# Altium schematic sheet MainPCB.SchDoc
size 381 x 241 mm
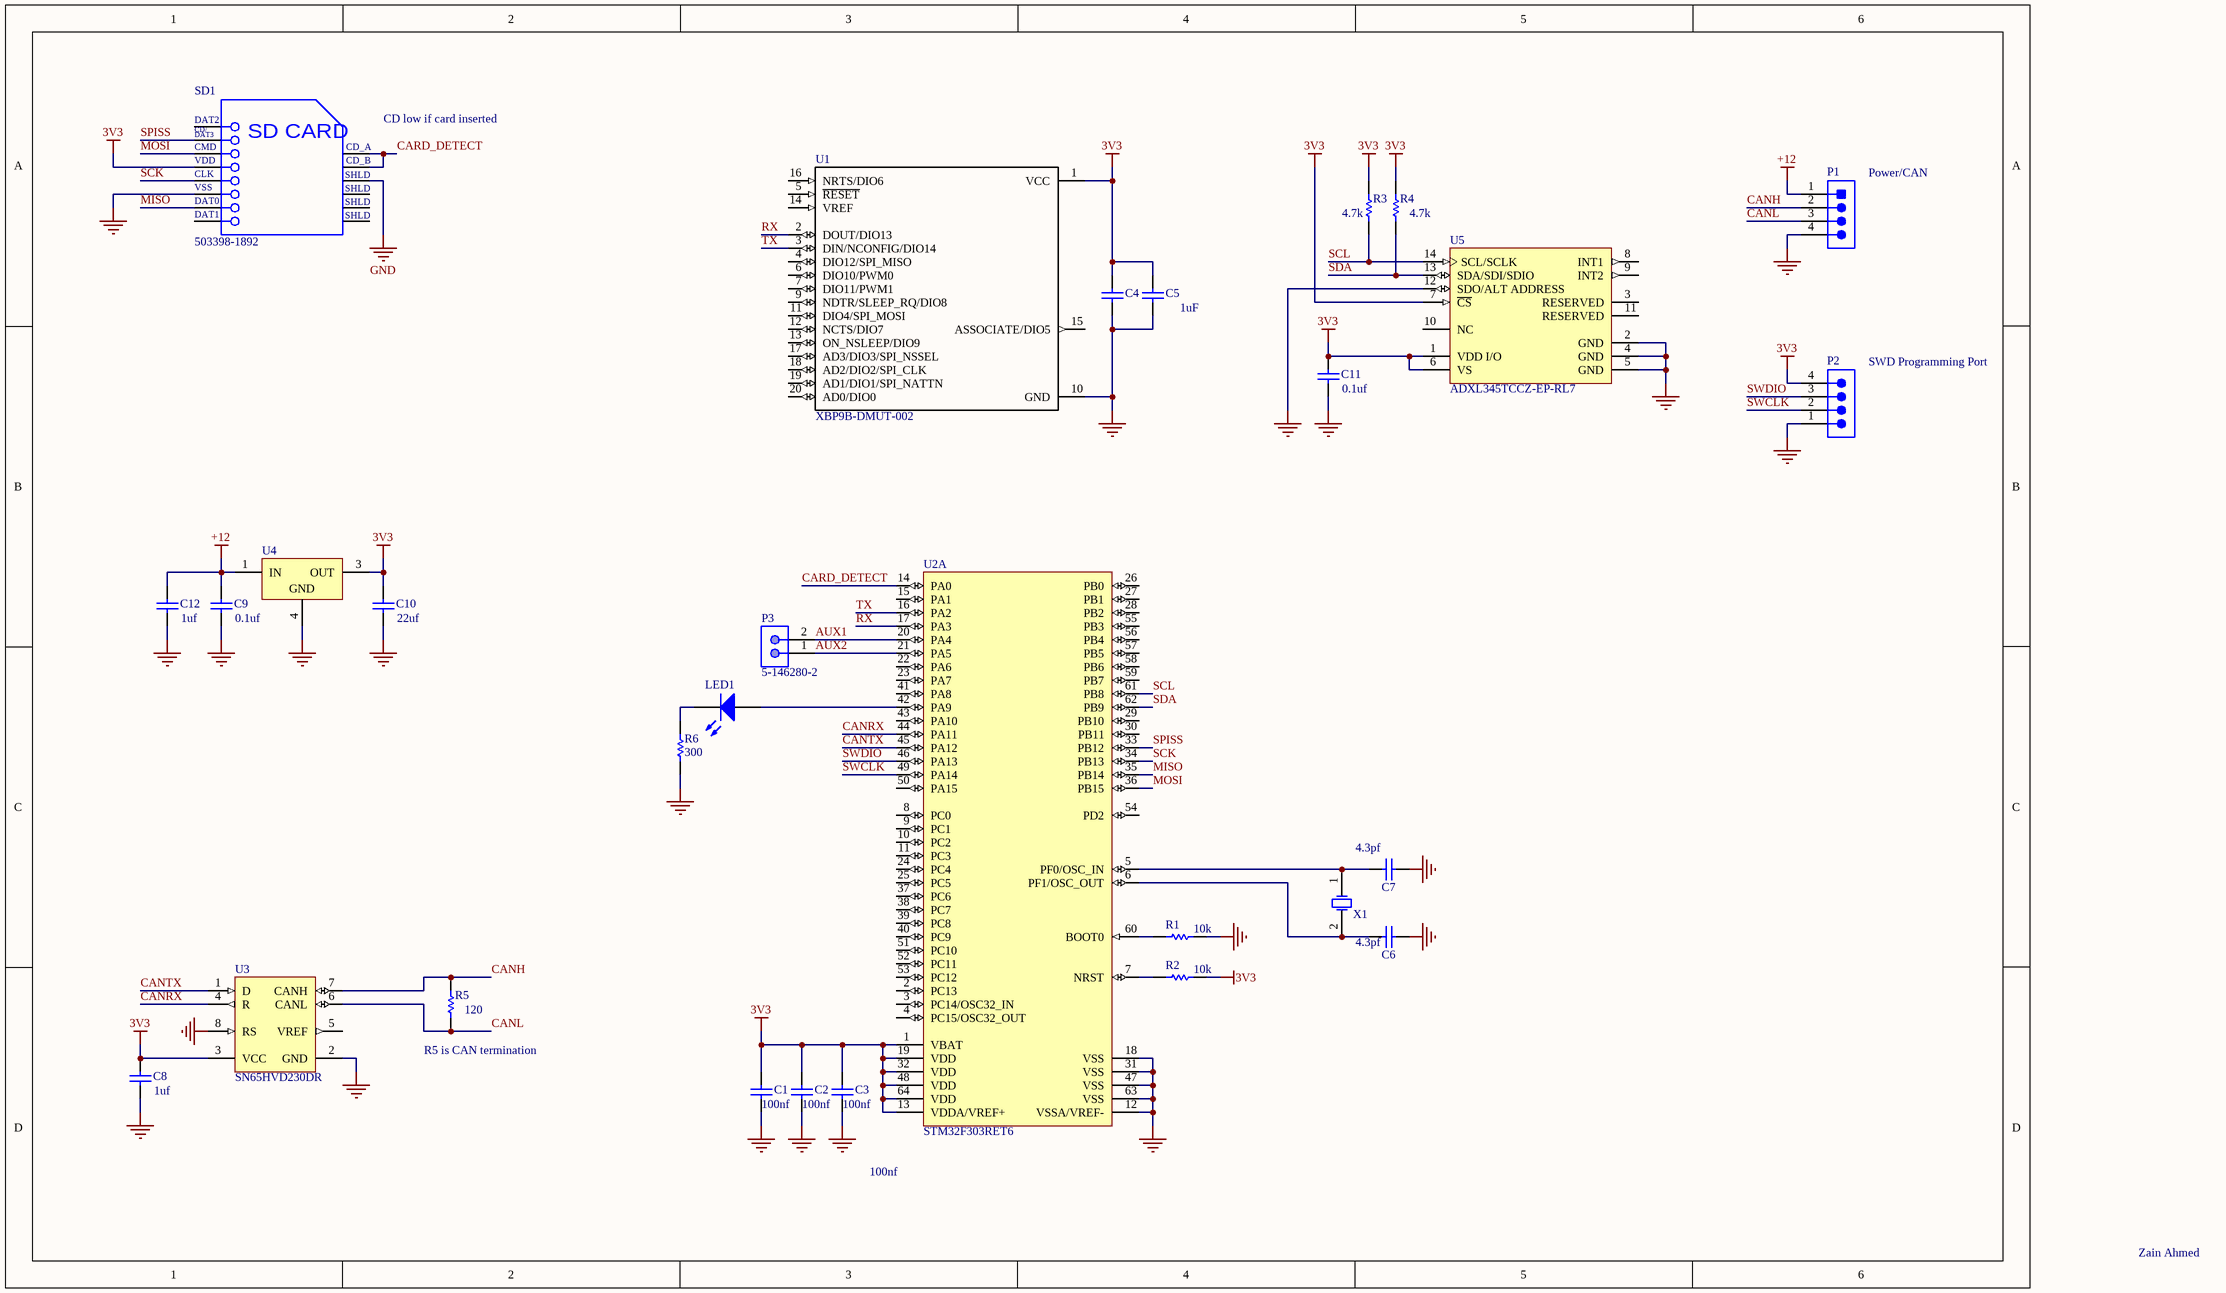
[diagram p0: MainPCB.SchDoc]

## Parts
C1  C0402C104K8PAC7867  [CAPC1005X60X30ML05T10]  (value not drawn)
C2  C0402C104K8PAC7867  [CAPC1005X60X30ML05T10]  (value not drawn)
C3  C0402C104K8PAC7867  [CAPC1005X60X30ML05T10]  (value not drawn)
C4  12065C105KAT2A  [CAPC3216X180X50LL20T25]  (value not drawn)
C5  12065C105KAT2A  [CAPC3216X180X50LL20T25]  (value not drawn)
C6  CAP 4.3pF 50V 0402(1005)  [CAPC0402(1005)60_M]  (value not drawn)
C7  CAP 4.3pF 50V 0402(1005)  [CAPC0402(1005)60_M]  (value not drawn)
C8  C1206C105K3RACTU  [CAPC3216X180X50ML20T25]  (value not drawn)
C9  GRM188R71H104KA93D  [CAPC1608X90X35ML10T15]  (value not drawn)
C10  GRM188R61A226ME15D  [CAPC1608X100X38LL20T18]  (value not drawn)
C11  GRM188R71H104KA93D  [CAPC1608X90X35ML10T15]  (value not drawn)
C12  GRM155R61A105KE15D  [CAPC1005X55X25NL05T10]  (value not drawn)
LED1  150120BS75000  [1206_A]  (value not drawn)
P1  B4B-PH-K-S(LF)(SN)  [JST-B4B-PH-K-S_V]  (value not drawn)
P2  TSW-104-08-T-S  [SMTC-TSW-104-08-X-S]  (value not drawn)
P3  5-146280-2  [TECO-5-146280-2_V]
R1  ERA8AEB103V  [RESC3216X70X50LL20T25]  (value not drawn)
R2  ERA8AEB103V  [RESC3216X70X50LL20T25]  (value not drawn)
R3  ERA6AEB472V  [RESC2013X60X40ML20T25]  (value not drawn)
R4  ERA6AEB472V  [RESC2013X60X40ML20T25]  (value not drawn)
R5  CRCW1206120RFKEA  [RESC3216X60X45LL10T20]  (value not drawn)
R6  300  [RESC3216X70X50NL05T20]
SD1  503398-1892  [MOLX-503398-1892_V]
U1  XBP9B-DMUT-002  [*DIP2200W51P200L3294H279Q20P]
U2A  STM32F303RET6  [STM-LQFP64_L]
U3  SN65HVD230DR  [D0008A_L]
U4  TL760M33QKVURQ1  [KVU0003A_M]  (value not drawn)
U5  ADXL345TCCZ-EP-RL7  [ADI-CC-14-1_V]
X1  ABM3-8.000MHZ-D2Y-T  [ABRA-ABM3-2_V]  (value not drawn)

## Nets
3V3: C1.1 C2.1 C3.1 C4.1 C5.1 C8.1 C10.1 C11.1 P2.4 R2.2 R3.1 R4.1 SD1.4(VDD) U1.1(VCC) U2A.1(VBAT) U2A.13(VDDA/VREF+) U2A.19(VDD) U2A.32(VDD) U2A.48(VDD) U2A.64(VDD) U3.3(VCC) U4.3(OUT) U5.1(VDD_I/O) U5.6(VS) U5.7(~{CS})
+12: C9.1 C12.1 P1.1 U4.1(IN)
GND: C1.2 C2.2 C3.2 C4.2 C5.2 C6.1 C7.1 C8.2 C9.2 C10.2 C11.2 C12.2 P1.4 P2.1 R1.2 R6.2 SD1.6(VSS) SD1.11(SHLD) U1.10(GND) U2A.12(VSSA/VREF-) U2A.18(VSS) U2A.31(VSS) U2A.47(VSS) U2A.63(VSS) U3.2(GND) U3.8(RS) U4.4(GND) U5.2(GND) U5.4(GND) U5.5(GND) U5.12(SDO/ALT_ADDRESS)
AUX1: P3.2 U2A.20(PA4)
AUX2: P3.1 U2A.21(PA5)
CANH: P1.2 R5.1 U3.7(CANH)
CANL: P1.3 R5.2 U3.6(CANL)
CANRX: U2A.44(PA11) U3.4(R)
CANTX: U2A.45(PA12) U3.1(D)
CARD_DETECT: SD1.9(CD_A) SD1.10(CD_B) U2A.14(PA0)
MISO: SD1.7(DAT0) U2A.35(PB14)
MOSI: SD1.3(CMD) U2A.36(PB15)
RX: U1.2(DOUT/DIO13) U2A.17(PA3)
SCK: SD1.5(CLK) U2A.34(PB13)
SCL: R3.2 U2A.61(PB8) U5.14(SCL/SCLK)
SDA: R4.2 U2A.62(PB9) U5.13(SDA/SDI/SDIO)
SPISS: SD1.2(CD/DAT3) U2A.33(PB12)
SWCLK: P2.2 U2A.49(PA14)
SWDIO: P2.3 U2A.46(PA13)
TX: U1.3(DIN/NCONFIG/DIO14) U2A.16(PA2)
NetC6_2: C6.2 U2A.6(PF1/OSC_OUT) X1.2(X2)
NetC7_2: C7.2 U2A.5(PF0/OSC_IN) X1.1(X1)
NetLED1_1: LED1.1(K) R6.1
NetLED1_2: LED1.2(A) U2A.42(PA9)
NetR1_1: R1.1 U2A.60(BOOT0)
NetR2_1: R2.1 U2A.7(NRST)

Not connected (* = marked no-connect by the designer): SD1 1(DAT2) 8(DAT1) 12(SHLD) 13(SHLD) 14(SHLD); U1 4(DIO12/SPI_MISO) 5(~{RESET}) 6(DIO10/PWM0) 7(DIO11/PWM1) 9(NDTR/SLEEP_RQ/DIO8) 11(DIO4/SPI_MOSI) 12(NCTS/DIO7) 13(ON_NSLEEP/DIO9) 14(VREF) 15(ASSOCIATE/DIO5) 16(NRTS/DIO6) 17(AD3/DIO3/SPI_NSSEL) 18(AD2/DIO2/SPI_CLK) 19(AD1/DIO1/SPI_NATTN) 20(AD0/DIO0); U2A 2(PC13) 3(PC14/OSC32_IN) 4(PC15/OSC32_OUT) 8(PC0) 9(PC1) 10(PC2) 11(PC3) 15(PA1) 22(PA6) 23(PA7) 24(PC4) 25(PC5) 26(PB0) 27(PB1) 28(PB2) 29(PB10) 30(PB11) 37(PC6) 38(PC7) 39(PC8) 40(PC9) 41(PA8) 43(PA10) 50(PA15) 51(PC10) 52(PC11) 53(PC12) 54(PD2) 55(PB3) 56(PB4) 57(PB5) 58(PB6) 59(PB7); U3 5(VREF); U5 3(RESERVED) 8(INT1) 9(INT2) 10(NC) 11(RESERVED)

## Notes on the sheet
- (near SD1) CD low if card inserted
- (near R3) 4.7k
- (near R4) 4.7k
- (near P1) Power/CAN
- (near C5) 1uF
- (near P2) SWD Programming Port
- (near C11) 0.1uf
- 1uf
- 0.1uf
- (near C10) 22uf
- (near C7) 4.3pf
- (near R1) 10k
- (near R2) 10k
- (near C6) 4.3pf
- (near R5) 120
- (near C8) 1uf
- (near R5) R5 is CAN termination
- (near C1) 100nf
- (near C2) 100nf
- (near C3) 100nf
- 100nf
- Zain Ahmed
- (in symbol CMP-2000-05621-1) CD/; DAT3; SD CARD

## Library data of the parts
C1-C3 = CMP-2008-02063-1: Manufacturer: Kemet; Part Number: C0402C104K8PAC7867
C4 C5 = CMP-2000-05866-1: Chip Capacitor, 1 uF, +/- 10%, 50 V, -55 to 125 degC, 1206 (3216 Metric), RoHS, Tape and Reel; Manufacturer: AVX; Capacitance: 1µF; Dielectric: X7R; Rated Voltage: 50V; Datasheet URL: http://datasheets.avx.com/X7RDielectric.pdf; Package Reference: 1206; Tolerance (%): ±10%; Mounting Technology: SurfaceMount; Case Size/Dimension: 1206; Package Description: 2-Pin Surface Mount Device, Body 3.2 x 1.6 mm; Datasheet Version: 07/2016; Manufacturer URL: http://www.avx.com/
C6 C7 = CMP-1034-00340-1: CAP 4.3pF 50V ±0.25pF 0402 (1005 Metric) Thickness 0.6mm SMD; Tolerance: Â±0.25pF; Case-EIA: 0402; Case-Metric: 1005; Value: 4.3pF; Rated Voltage: 50 V; Technology: SMT; Max Thickness: 0.6 mm
C8 = CMP-2000-04991-1: Chip Capacitor, 1 uF, +/- 10%, 25 V, -55 to 125 degC, 1206 (3216 Metric), RoHS, Tape and Reel; Manufacturer: Kemet; Temperature Coefficient / Code: +/-15%; Capacitance: 1uF; Dielectric: X7R; Voltage Rating DC: 25V; Capacitance - nF: 1000nF; Class: Class1; Case Length: 3.2mm; Type: SMDMLCCX7R6.3-250VDCCommericalGrade; Case Width: 1.6mm; Product: GeneralTypeMLCCs; Datasheet URL: https://ciiva.com/datasheet-click-18194173?src=ciiva&sig=6daff8c4; Operating Temperature Range: -55Cto+125C; Series: C1206C; RoHS: Details; Product Category: MultilayerCeramicCapacitorsMLCC-SMD/SMT; Manufacturer URL: http://www.kemet.com/; Minimum Operating Temperature: -55C; Dimensions: 1.6mmWx3.2mmLx1.6mmH; Termination Style: SMD/SMT; Brand: Kemet; Packaging: Reel; Package / Case: 1206(3216metric); Case Code - mm: 3216; Datasheet Version: Jul-14; Factory Pack Quantity: 2000; Package Description: 2-Pin Surface Mount Device, Body 3.2 x 1.6 mm; Tolerance: 10%; Package Reference: 1206; Case Height: 1.6mm; Case Code - in: 1206; Maximum Operating Temperature: +125C; Voltage Rating: 25V
C9 C11 = CMP-2100-03643-1: Chip Capacitor, 0.1 uF, +/- 10%, 50 V, -55 to 125 degC, 0603 (1608 Metric), RoHS, Tape and Reel; Manufacturer: Murata; Dielectric Material: Ceramic; Voltage Rating: 50V; Capacitance: 100nF; Dielectric: X7R; Insulation Resistance: 10GR; Case Code (Metric): 1608; Lead Free: LeadFree; Depth: 0.8mm; Number of Pins: 2; Radiation Hardening: No; Case/Package: 0603; Manufacturer URL: http://www.murata.com/; Packaging: TapeandReel; Length: 1.6mm; Contact Plating: Tin; Datasheet URL: http://psearch.en.murata.com/capacitor/product/GRM188R71H104KA93%23.pdf; Tolerance: 10%; Case Code (Imperial): 0603; Min Operating Temperature: -55degC; RoHSCompliant: true; Voltage: 50V; Termination: SMD/SMT; Mount: SurfaceMount; Material: Ceramic; Package Quantity: 1; Height: 0.8mm; Thickness: 0.035inch; REACH SVHC: NoSVHC; Max Operating Temperature: 125degC; Width: 0.8mm; Package Reference: 0603; Voltage Rating (DC): 50V; Datasheet Version: 42675.0; Package Description: 2-Pin Surface Mount Device, Body 1.6 x 0.8 mm
C10 = CMP-2000-06337-1: Chip Capacitor, 22 uF, +/- 20%, 10 V, -55 to 85 degC, 0603 (1608 Metric), RoHS, Tape and Reel; Manufacturer: Murata; Voltage Rating DC: 10VDC; Capacitance: 22uF; Dielectric: X5R; Unit Weight: 0.000222oz; Brand: MurataElectronics; Type: VoltageandTemperatureDeratingRecommendedProduct; Case Code - in: 0603; Package Reference: 1608; Package Description: 2-Pin Surface Mount Device, Body 1.6 x 0.8 mm; Width: 0.8mm; Factory Pack Quantity: 4000; Series: GRM; Product Category: MultilayerCeramicCapacitorsMLCC-SMD/SMT; Length: 1.6mm; Datasheet URL: http://download.siliconexpert.com/pdfs/2016/4/15/5/14/5/748/mrt_/manual/267693161154190grm188r61a226me1523.pdf; Termination Style: SMD/SMT; RoHS: True; Packaging: Reel; Datasheet Version: 04/2016; Minimum Operating Temperature: -55C; Tolerance: 20%; Height: 0.8mm; Package / Case: 0603(1608metric); Mounting Technology: SurfaceMount; Manufacturer URL: http://www.murata.com/; Product: GeneralTypeMLCCs; Maximum Operating Temperature: +85C; Case Code - mm: 1608
C12 = CMP-2008-04556-1: Manufacturer: Murata; Part Number: GRM155R61A105KE15D
LED1 = CMP-1426-00015-1: SMD mono-color Chip LED, WL-SMCW, Blue; Manufacturer: Wuerth Elektronik; ComponentLink2Description: Datasheet; ComponentLink1URL: http://www.we-online.com; PartNumber: 150120BS75000; ComponentLink1Description: Manufacturer URL; ComponentLink2URL: http://katalog.we-online.com/led/datasheet/150120BS75000.pdf; PackageReference: 1206_A; Color: Blue
P1 = CMP-2000-05165-1: Male Header, Pitch 2 mm, 1 x 4 Position, Height 6 mm, Tail Length 3.4 mm, -25 to 85 degC, RoHS, Bulk; Manufacturer: JST; No of Positions: 4; Style/Orientation: StraightHeader/Plug; Pitch: 2mm; Datasheet URL: http://datasheet.octopart.com/B4B-PH-K-S%28LF%29%28SN%29-JST-datasheet-10558886.pdf; Type: ShroudedHeader; Manufacturer URL: http://www.jst.com/home2.html; Termination: Crimp; Datasheet Version: Apr-09
P2 = CMP-1024-00356-1: 0.025" SQ Post Header, Through-hole, Vertical, -55 to 105 degC, 2.54 mm Pitch, 4-Pin, Male, RoHS; Manufacturer: Samtec; Pitch: 2.54 mm; PackageDescription: .025[0.64] SQ. Post Terminal Strip Assembly; ComponentLink2URL: http://www.samtec.com/documents/webfiles/pdf/TSW_TH.PDF; ComponentLink3URL: http://www.samtec.com/documents/webfiles/cpdf/TSW-XXX-XX-XXX-X-XX-XXX-MKT.pdf; PackageVersion: DM, 8/1988; ComponentLink3Description: Package Specification; DatasheetVersion: F-214; Orientation: Vertical; RoHS: True; Mounting Technology: Through-hole; ComponentLink1URL: http://www.samtec.com; PartNumber: TSW-104-08-T-S; ComponentLink1Description: Manufacturer URL; Temperature Range: -55 to 105 degC; ComponentLink2Description: Datasheet; PackageReference: TSW-104-08-X-S
P3 = CMP-2000-07492-1: Male Header, Pitch 2.54 mm, 1 x 2 Position, Height 8.21 mm, Tail Length 3.05 mm, -65 to 105 degC, RoHS, Bulk; Manufacturer: TE Connectivity; Mating Connector Lock: No(Without); Number of Positions: 2; Pitch: 2.54mm; PCB Mounting Orientation: Vertical; Keyed: No; Case\/Package: 100; Mating Post Length: 0.23inch; High Temperature Housing: Yes; Max Current Rating: 5A; PCB Thickness: 0.063inch; PCB Mount Retention: Without; Approvals: CSA; Current Rating: 3A; Radiation Hardening: No; Length: 4.67mm; Contact Mating Length: 0.23inch; Connector Type: Header; Number of Rows: 1; Termination Post Length: 0.12inch; Board Standoff: No(Without); Max Operating Temperature: 105degC; Contact Shape: Square; Selectively Loaded: No(Without); Gasket: No(Without); Number of Contacts: 2; Contact Gender: Male; Mating Alignment: No(Without); Manufacturer URL: http://www.te.com/; Datasheet URL: http://www.te.com/commerce/DocumentDelivery/DDEController?Action=showdoc&DocId=Customer+Drawing%7F146280%7FH1%7Fpdf%7FEnglish%7FENG_CD_146280_H1.pdf%7F5-146280-2; Mount: ThroughHole; Orientation: Straight; Packaging: Carton; Package Reference: 5-146280-2; Package Quantity: 500; Stabilizers: No(Without); Row Spacing: 2.54mm; Contact Material: CopperAlloy; Panel Mount Retention: No(Without); Datasheet Version: Rev. H1, 08/2016; Housing Colour: Black; Colour: Black; Package Description: Male Header, Pitch 2.54 mm, 1 x 2 Position, Height 8.21 mm, Tail Length 3.05 mm; Contact Plating: Matte; Housing Material: Polymer; Contact Protection: No(Without); Min Operating Temperature: -65degC; Mounting Technology: ThroughHole; Flammability Rating: UL94V-0; RoHSCompliant: true; Termination: ThroughHole; Depth: 2.34mm; High Speed Serial Data Connector: No
R1 R2 = CMP-2003-04407-1: Manufacturer: Panasonic; Part Number: ERA8AEB103V
R3 R4 = CMP-2001-00644-1: Manufacturer: Panasonic; Part Number: ERA6AEB472V
R5 = CMP-2003-04838-1: Manufacturer: Vishay Dale; Part Number: CRCW1206120RFKEA
R6 = CMP-2003-00831-1: Manufacturer: Panasonic; Part Number: ERJ8ENF3000V
SD1 = CMP-2000-05621-1: Micro SD Connector, Pitch 1.1 mm, 8 Position, Height 1.4 mm, -25 to 85 degC, RoHS, Tape and Reel; Manufacturer: Molex; Voltage Rating: 10VAC/DC; Current Rating: 500mA; Manufacturer URL: http://www.molex.com/; Package Reference: 503398-1892; Packaging: Reel; RoHS: Details; Brand: Molex; Datasheet URL: http://www.molex.com/pdm_docs/sd/5033981892_sd.pdf; Mounting Technology: SurfaceMount; Factory Pack Quantity: 2400; Datasheet Version: Rev. E, 04/2006; Series: 503398; Product Category: MemoryCardConnectors; Package Description: Micro SD Connector, Pitch 1.1 mm, 8 Position, Height 1.4 mm
U1 = XBP9B-DMUT-002: XBee-PRO 900HP DigiMesh 900 MHz 200 Kbps RF Module with U.FL Connector; MF: Digi International; SnapEDA_Link: https://www.snapeda.com/parts/XBP9B-DMUT-002/Digi%20International/view-part/?ref=snap; Availability: Unavailable; Price: None; MP: XBP9B-DMUT-002; Package: Module Digi International; Value: *
U2A = CMP-0537-00048-1: ARM Cortex-M4 32-bit MCU, 512 KB Flash, 80 KB Internal RAM, 51 I/Os, 64-Pin LQFP, -40 to 85 degC, Tray; Operating Frequency(F) (Processor speed) (MHz): 72; FLASH Size (Prog) (kB): 512; Internal RAM Size (kB): 80; I/Os (High Current): 51; D/A Converter: 2; ComponentLink2Description: Datasheet; ComponentLink1URL: http://www.st.com/; ComponentLink1Description: Manufacturer URL; Package Description: 64-Pin Low-profile Quad Flat Package, Body 10 x 10 mm, Pitch 0.5 mm; Package Reference: LQFP64; Mounting Technology: Surface Mount; Packing: Tray; Core: ARM Cortex-M4; ComponentLink2URL: http://www.st.com/st-web-ui/static/active/en/resource/technical/document/datasheet/DM00118585.pdf; DatasheetVersion: Rev. 5; Supply Voltage(Vcc) min (V): 2
U3 = CMP-0315-00015-2: 3.3V CAN Transceiver with Standby Mode, 17 mA, -40 to 85 degC, 8-pin SOIC (D), Green (RoHS & no Sb/Br); Manufacturer: Texas Instruments; Rating: Catalog; Transient Pulse Protection(V): -25 to 25; Receivers Per Package: 1; ICC(Max)(mA): 17; Supply Voltage(s)(V): 3.3; Low Power Mode: Standby; Mounting Technology: Surface Mount; PackageReference: D0008A; Footprint: PCA82C250; ComponentLink1URL: http://www.ti.com/general/docs/lit/getliterature.tsp?genericPartNumber=SN65HVD230&fileType=pdf; Code_JEDEC: MS-012AA; ComponentLink1Description: Datasheet; Eco-Plan: Green (RoHS & no Sb/Br); PartNumber: SN65HVD230DR; PackageDescription: 8-Pin Plastic Small Outline Integrated Circuit, 4.9 x 3.9 mm, Pitch 1.27 mm Pitch; Isolated: No; DatasheetVersion: SLOS346K; PackageVersion: revM, Jun-2011; SubFamily: CAN; Drivers Per Package: 1
U4 = CMP-0395-01069-2: Single Output Automotive LDO, 500 mA, Fixed 3.3 V Output, 3.8 to 26 V Input, 3-pin PFM (KVU), -40 to 125 degC, Green (RoHS & no Sb/Br); Manufacturer: Texas Instruments; Vout Adj(Max)(V): 3.3; Iout(Max)(A): 0.5; Vin(Min)(V): 3.8; Vin(Max)(V): 26; Vdo(Typ)(mV): 500; Accuracy(%): 3; SubFamily: Single Channel LDO; Iq(Typ)(mA): 20; Fixed Output Options(V): 3.3; ComponentLink3URL: http://www.ti.com/litv/pdf/mpsf018c; ComponentLink2Description: Datasheet; PartNumber: TL760M33QKVURQ1; Rating: Automotive; ComponentLink2URL: http://www.ti.com/general/docs/lit/getliterature.tsp?genericPartNumber=TL760M33-Q1&fileType=pdf; Eco-Plan: Green (RoHS & no Sb/Br); ComponentLink1URL: http://www.ti.com/; Mounting Technology: Surface Mount; ComponentLink4URL: Samples URL:http://www.ti.com/product/tl760m33-q1#samples; Code_JEDEC: TO-252; ComponentLink3Description: Package Specification; PackageReference: KVU0003A; Vout Adj(Min)(V): 3.3; ComponentLink1Description: Manufacturer URL; ComponentLink4Description: URL Link1; DatasheetVersion: SGLS284I; PackageDescription: 3-Pin Plastic Flange Mount, Body 6.1 x 6.6 mm, Pitch 2.29 mm; PackageVersion: 4205521-2/D
U5 = CMP-0885-00032-1: 3-Axis, +/-2 g / +/-4 g / +/-8 g / +/-16 g Digital Accelerometer with Digital Output, 1.6 KHz BW, Industrial, 14-pin LGA, Reel; Manufacturer: Analog Devices; # of Axes: 3; Sensitivity: 256/128/64/32 LSB/g; Voltage Supply (V): 2.0 to 3.6; -3dB Bandwidth: 1.6 KHz; Supply Current: 140 uA; ComponentLink4Description: Product URL; PackageDescription: 14-Pin Land Grid Array, 3 x 5 mm Body, 0.8 mm Pitch; Mounting Technology: Surface Mount; DatasheetVersion: Rev. A; PackageVersion: 03-16-2010-A, 03/2010; Output Type: Digital; PartNumber: ADXL345TCCZ-EP-RL7; Packing: Reel; ComponentLink3Description: Package Specification; ComponentLink1URL: http://www.analog.com/en/index.html; ComponentLink3URL: http://www.analog.com/static/imported-files/data_sheets/ADXL343.pdf; ComponentLink2URL: http://www.analog.com/static/imported-files/data_sheets/ADXL345-EP.pdf; PackageReference: CC-14-1; ComponentLink4URL: http://www.analog.com/en/mems-sensors/mems-inertial-sensors/adxl345/products/product.html; ComponentLink2Description: Datasheet; ComponentLink1Description: Manufacturer URL
X1 = CMP-2000-05033-1: Miniature Ceramic Crystal, 8 MHz, -40 to 85 degC, 2-Pin SMD, RoHS, Tape and Reel; Manufacturer: ABRACON; Case Length: 5mm; Case Width: 3.2mm; Case Height: 1.3mm; Load Capacitance: 18pF; Frequency: 8MHz; Frequency Stability: 30PPM; ESR: 140Ohms; Tolerance: 20PPM; Type: MiniatureCeramicCrystal; Factory Pack Quantity: 1000; Package / Case: 5mmx3.2mm; Mounting Style: SMD/SMT; Manufacturer URL: http://www.abracon.com/; RoHS: Details; Dimensions: 3.2mmWx5mmLx1.3mmH; Datasheet URL: http://www.farnell.com/datasheets/1754353.pdf; Brand: ABRACON; Packaging: Reel; Product Category: Crystals; Package Description: 2-Pin Surface Mount Device, Body 5 x 3.2 mm; Package URL: http://www.abracon.com/Support/PackageDrawing/Resonators/ABM3.PDF; Operating Temperature Range: -40Cto+85C; Termination Style: SMD/SMT; Datasheet Version: Sep-13; Series: ABM3; Package Reference: ABM3-2